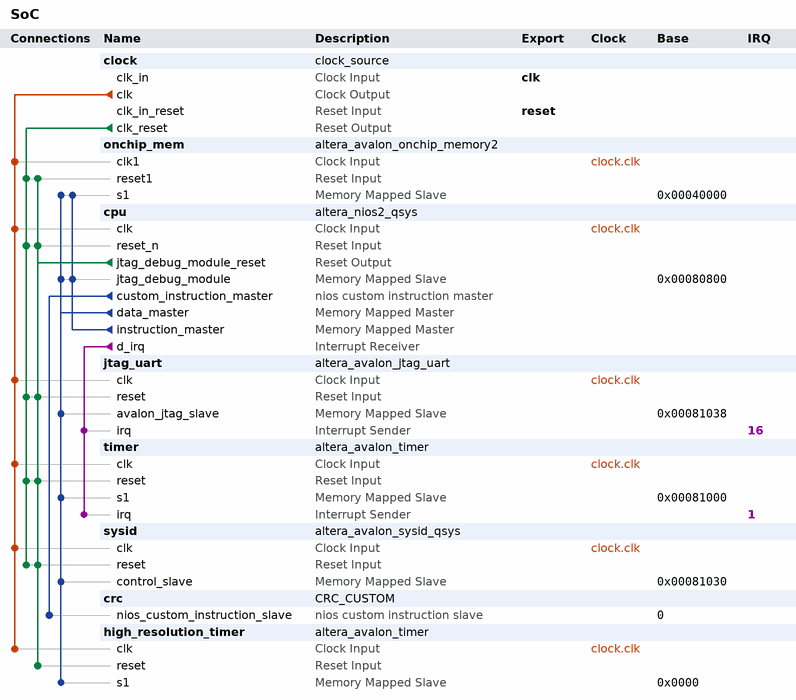
[diagram p0: system contents]
# Platform Designer (Qsys) system SoC, Cyclone IV E EP4CE115F29C7
# Parameters at their usual value, and those the tool derives, are not listed.
package require -exact qsys 13.1
create_system SoC
set_project_property DEVICE_FAMILY {Cyclone IV E}
set_project_property DEVICE EP4CE115F29C7

add_instance clock clock_source 13.1
set_instance_parameter_value clock clockFrequency 50000000

add_instance onchip_mem altera_avalon_onchip_memory2 13.1
set_instance_parameter_value onchip_mem dataWidth 32
set_instance_parameter_value onchip_mem dualPort false
set_instance_parameter_value onchip_mem initMemContent true
set_instance_parameter_value onchip_mem initializationFileName onchip_mem.hex
set_instance_parameter_value onchip_mem memorySize 262144

add_instance cpu altera_nios2_qsys 13.1
set_instance_parameter_value cpu resetSlave onchip_mem.s1
set_instance_parameter_value cpu mmu_TLBMissExcSlave None
set_instance_parameter_value cpu exceptionSlave onchip_mem.s1
set_instance_parameter_value cpu breakSlave cpu.jtag_debug_module
set_instance_parameter_value cpu muldiv_multiplierType NoneSmall
set_instance_parameter_value cpu impl Small
set_instance_parameter_value cpu icache_size 4096

add_instance jtag_uart altera_avalon_jtag_uart 13.1
set_instance_parameter_value jtag_uart simInteractiveOptions NO_INTERACTIVE_WINDOWS

add_instance timer altera_avalon_timer 13.1
set_instance_parameter_value timer period 1
set_instance_parameter_value timer periodUnits MSEC

add_instance sysid altera_avalon_sysid_qsys 13.1
set_instance_parameter_value sysid id 0

add_instance crc CRC_CUSTOM 1.0
set_instance_parameter_value crc crc_width 32
set_instance_parameter_value crc polynomial_inital 4294967295
set_instance_parameter_value crc polynomial 79764919
set_instance_parameter_value crc reflected_input 1
set_instance_parameter_value crc reflected_output 1
set_instance_parameter_value crc xor_output 4294967295

add_instance high_resolution_timer altera_avalon_timer 13.1
set_instance_parameter_value high_resolution_timer period 1
set_instance_parameter_value high_resolution_timer periodUnits USEC

# connections
add_connection clock.clk cpu.clk clock
add_connection clock.clk high_resolution_timer.clk clock
add_connection clock.clk jtag_uart.clk clock
add_connection clock.clk onchip_mem.clk1 clock
add_connection clock.clk sysid.clk clock
add_connection clock.clk timer.clk clock
add_connection clock.clk_reset cpu.reset_n reset
add_connection clock.clk_reset jtag_uart.reset reset
add_connection clock.clk_reset onchip_mem.reset1 reset
add_connection clock.clk_reset sysid.reset reset
add_connection clock.clk_reset timer.reset reset
add_connection cpu.jtag_debug_module_reset cpu.reset_n reset
add_connection cpu.jtag_debug_module_reset high_resolution_timer.reset reset
add_connection cpu.jtag_debug_module_reset jtag_uart.reset reset
add_connection cpu.jtag_debug_module_reset onchip_mem.reset1 reset
add_connection cpu.jtag_debug_module_reset sysid.reset reset
add_connection cpu.jtag_debug_module_reset timer.reset reset
add_connection cpu.data_master cpu.jtag_debug_module avalon
set_connection_parameter_value cpu.data_master/cpu.jtag_debug_module baseAddress 0x00080800
add_connection cpu.data_master high_resolution_timer.s1 avalon
set_connection_parameter_value cpu.data_master/high_resolution_timer.s1 baseAddress 0x0000
add_connection cpu.data_master jtag_uart.avalon_jtag_slave avalon
set_connection_parameter_value cpu.data_master/jtag_uart.avalon_jtag_slave baseAddress 0x00081038
add_connection cpu.data_master onchip_mem.s1 avalon
set_connection_parameter_value cpu.data_master/onchip_mem.s1 baseAddress 0x00040000
add_connection cpu.data_master sysid.control_slave avalon
set_connection_parameter_value cpu.data_master/sysid.control_slave baseAddress 0x00081030
add_connection cpu.data_master timer.s1 avalon
set_connection_parameter_value cpu.data_master/timer.s1 baseAddress 0x00081000
add_connection cpu.instruction_master cpu.jtag_debug_module avalon
set_connection_parameter_value cpu.instruction_master/cpu.jtag_debug_module baseAddress 0x00080800
add_connection cpu.instruction_master onchip_mem.s1 avalon
set_connection_parameter_value cpu.instruction_master/onchip_mem.s1 baseAddress 0x00040000
add_connection cpu.d_irq jtag_uart.irq interrupt
set_connection_parameter_value cpu.d_irq/jtag_uart.irq irqNumber 16
add_connection cpu.d_irq timer.irq interrupt
set_connection_parameter_value cpu.d_irq/timer.irq irqNumber 1
add_connection cpu.custom_instruction_master crc.nios_custom_instruction_slave nios_custom_instruction
set_connection_parameter_value cpu.custom_instruction_master/crc.nios_custom_instruction_slave CIName crc
set_connection_parameter_value cpu.custom_instruction_master/crc.nios_custom_instruction_slave baseAddress 0

# exported interfaces
add_interface clk clock sink
set_interface_property clk EXPORT_OF clock.clk_in
add_interface reset reset sink
set_interface_property reset EXPORT_OF clock.clk_in_reset

set_interconnect_requirement {$system} qsys_mm.clockCrossingAdapter HANDSHAKE
set_interconnect_requirement {$system} qsys_mm.maxAdditionalLatency 1
set_interconnect_requirement {$system} qsys_mm.insertDefaultSlave false

save_system SoC.qsys
